# Altium schematic sheet PowerSupply.SchDoc
size A4; Organization: Altium Limited; Address1: L3, 12a Rodborough Rd; Address2: Frenchs Forest; Address3: NSW; Address4: Australia 2086
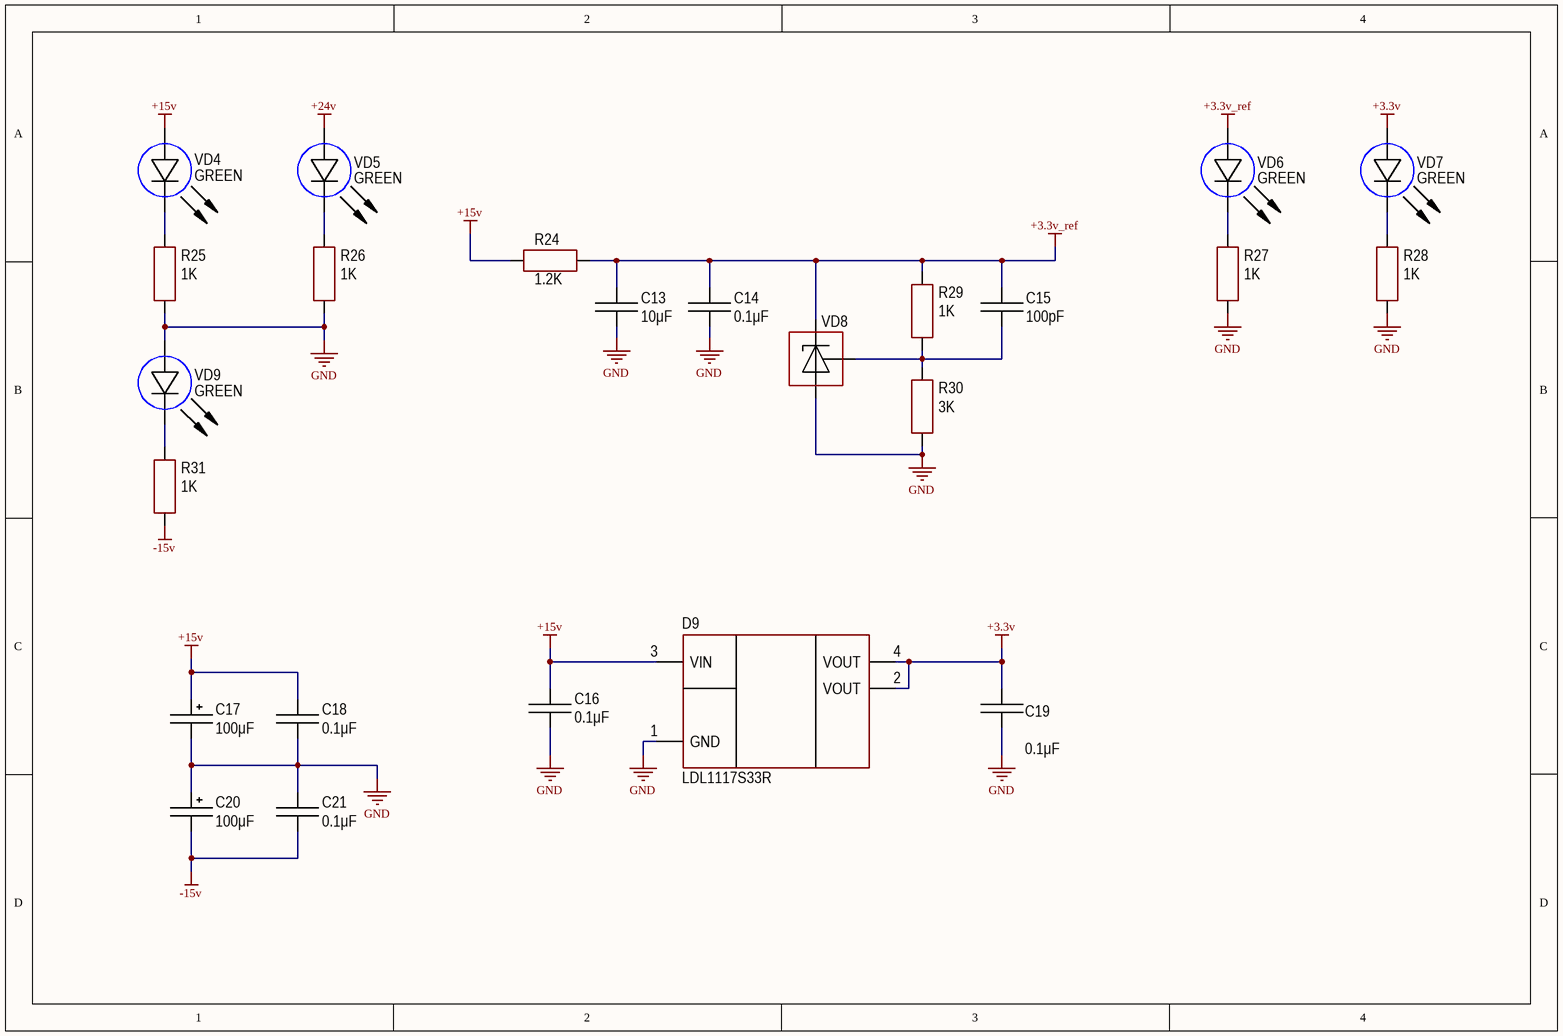
[diagram p0: PowerSupply.SchDoc]

## Parts
C13  value 10μF  [CAP: 1206]
C14  value 0.1μF  [CAP: 1206]
C15  value 100pF  [CAP: 1206]
C16  value 0.1μF  [CAP: 1206]
C17  value 100μF  [CAPAE7466X80L]
C18  value 0.1μF  [CAP: 1206]
C19  value 0.1μF  [CAP: 1206]
C20  value 100μF  [CAPAE7466X80L]
C21  value 0.1μF  [CAP: 1206]
D9  (no value)  [SOT223]
R24  value 1.2K  [RES: 1206]
R25  value 1K  [RES: 1206]
R26  value 1K  [RES: 1206]
R27  value 1K  [RES: 1206]
R28  value 1K  [RES: 1206]
R29  value 1K  [RES: 1206]
R30  value 3K  [RES: 1206]
R31  value 1K  [RES: 1206]
VD4  Color: GREEN  [LED: 1206G]
VD5  Color: GREEN  [LED: 1206G]
VD6  Color: GREEN  [LED: 1206G]
VD7  Color: GREEN  [LED: 1206G]
VD8  (no value)  [SOT23]
VD9  Color: GREEN  [LED: 1206G]

## Nets
+3.3v: C19.2 D9.2(VOUT) D9.4(VOUT) VD7.1(A)
+3.3v_ref: C13.1 C14.1 C15.1 R24.1 R29.2 VD6.1(A) VD8.1
+15v: C16.2 C17.1 C18.2 D9.3(VIN) R24.2 VD4.1(A)
+24v: VD5.1(A)
-15v: C20.2 C21.1 R31.2
GND: C13.2 C14.2 C16.1 C17.2 C18.1 C19.1 C20.1 C21.2 D9.1(GND) R25.1 R26.1 R27.1 R28.1 R30.1 VD8.3 VD9.1(A)
NetC15_2: C15.2 R29.1 R30.2 VD8.2
NetR25_2: R25.2 VD4.2(C)
NetR26_2: R26.2 VD5.2(C)
NetR27_2: R27.2 VD6.2(C)
NetR28_2: R28.2 VD7.2(C)
NetR31_1: R31.1 VD9.2(C)

## Notes on the sheet
- Title
- Size:
- Date:
- File:
- A0
- Number:
- Time:
- Revision:
- Sheet
- of

## Library data of the parts
C13 = Ceramic_1206: Manufacturer: Yageo; PartNumber: CC1206KRX7R9BB104; ValueManufacturerPartNumber: Ceramic capacitor, 10μF, X7R, ±10%, 50V, 1206, -55...+125°C; TypeCapacitor: Ceramic capacitor; Tolerance: ±10%; TypeDielectric: X7R; Voltage: 50V; Package: 1206; HelpURL: https://www.digikey.com/product-detail/en/yageo/CC1206KRX7R9BB104/311-1179-1-ND/303089; Temperature: -55...+125°C
C14 C16 C18 C19 C21 = Ceramic_1206: Manufacturer: Yageo; PartNumber: CC1206KRX7R9BB104; ValueManufacturerPartNumber: Ceramic capacitor, 0.1μF, X7R, ±10%, 50V, 1206, -55...+125°C; TypeCapacitor: Ceramic capacitor; Tolerance: ±10%; TypeDielectric: X7R; Voltage: 50V; Package: 1206; HelpURL: https://www.digikey.com/product-detail/en/yageo/CC1206KRX7R9BB104/311-1179-1-ND/303089; Temperature: -55...+125°C
C15 = Ceramic_1206: Manufacturer: Yageo; PartNumber: CC1206KRX7R9BB104; ValueManufacturerPartNumber: Ceramic capacitor, 100pF, X7R, ±10%, 50V, 1206, -55...+125°C; TypeCapacitor: Ceramic capacitor; Tolerance: ±10%; TypeDielectric: X7R; Voltage: 50V; Package: 1206; HelpURL: https://www.digikey.com/product-detail/en/yageo/CC1206KRX7R9BB104/311-1179-1-ND/303089; Temperature: -55...+125°C
C17 C20 = Aluminium: Manufacturer: Wurth; PartNumber: EEEFK1V101XP; ValueManufacturerPartNumber: EEEFK1V101XP, 100μF, 35V, D8; TypeCapacitor: Aluminium capacitor; Tolerance: ±20%; Impedance: 54mOhm; Voltage: 35V; Package: D8; HelpURL: https://www.digikey.com/product-detail/en/wurth-electronics-inc/860080475013/732-9029-1-ND/5728972; Temperature: -55...+105°C
D9 = LDL1117S33R: Linear voltage regulator; Manufacturer: STMicroelectronics; ValueManufacturerPartNumber: Linear voltage regulator, input 3.9...18V, 0.6V, output 3.3V, 1.2A, -40...+85°C, SOT223; VoltageInput: input 3.9...18V; MaxDropout: 0.6V; CurrentOutput: 1.2A; VoltageOutput: output 3.3V; HelpURL: https://www.digikey.com/product-detail/en/stmicroelectronics/LDL1117S33R/497-17239-1-ND/7102079; Package: SOT223; ComponentType: Linear voltage regulator; Temperature: -40...+85°C; PartNumber: LDL1117S33R
R24 = Resistor_1206: Manufacturer: Yageo; PartNumber: RC1206JR-07100RL; ValueManufacturerPartNumber: Resistor film, 1.2K, ±5%, 1206, 0.25W, -55...+125°C; TypeResistor: Resistor film; Power: 0.25W; Tolerance: ±5%; Package: 1206; HelpURL: https://www.digikey.com/product-detail/en/yageo/RC1206JR-07100RL/311-100ERCT-ND/732153; Temperature: -55...+125°C
R25-R29 R31 = Resistor_1206: Manufacturer: Yageo; PartNumber: RC1206JR-07100RL; ValueManufacturerPartNumber: Resistor film, 1K, ±5%, 1206, 0.25W, -55...+125°C; TypeResistor: Resistor film; Power: 0.25W; Tolerance: ±5%; Package: 1206; HelpURL: https://www.digikey.com/product-detail/en/yageo/RC1206JR-07100RL/311-100ERCT-ND/732153; Temperature: -55...+125°C
R30 = Resistor_1206: Manufacturer: Yageo; PartNumber: RC1206JR-07100RL; ValueManufacturerPartNumber: Resistor film, 3K, ±5%, 1206, 0.25W, -55...+125°C; TypeResistor: Resistor film; Power: 0.25W; Tolerance: ±5%; Package: 1206; HelpURL: https://www.digikey.com/product-detail/en/yageo/RC1206JR-07100RL/311-100ERCT-ND/732153; Temperature: -55...+125°C
VD4-VD7 VD9 = LED_single: ValueManufacturerPartNumber: LED, Green, *, *, *, -55...+150°C; TypeDiode: LED; Manufacturer: *; Package: *; HelpURL: *; Temperature: -55...+150°C; Current: *; VoltageDrop: *; PartNumber: *; ColorParameter: Green
VD8 = Zener_program: Manufacturer: Texas Instruments; ValueManufacturerPartNumber: Program zener diode, 36V, 100mA, 2.495V, ±1%, SOT-23, 0...+70°C; PartNumber: TL431; TypeDiode: Program zener diode; Current: 100mA; VoltageDrop: 2.495V; Tolerance: ±1%; Voltage: 36V; Package: SOT-23; HelpURL: https://www.digikey.com/product-detail/en/texas-instruments/TL431ACDBZR/296-17328-1-ND/686884; Temperature: 0...+70°C